# EAGLE design BlinkyTape Controller (EAGLE 7.2.0)
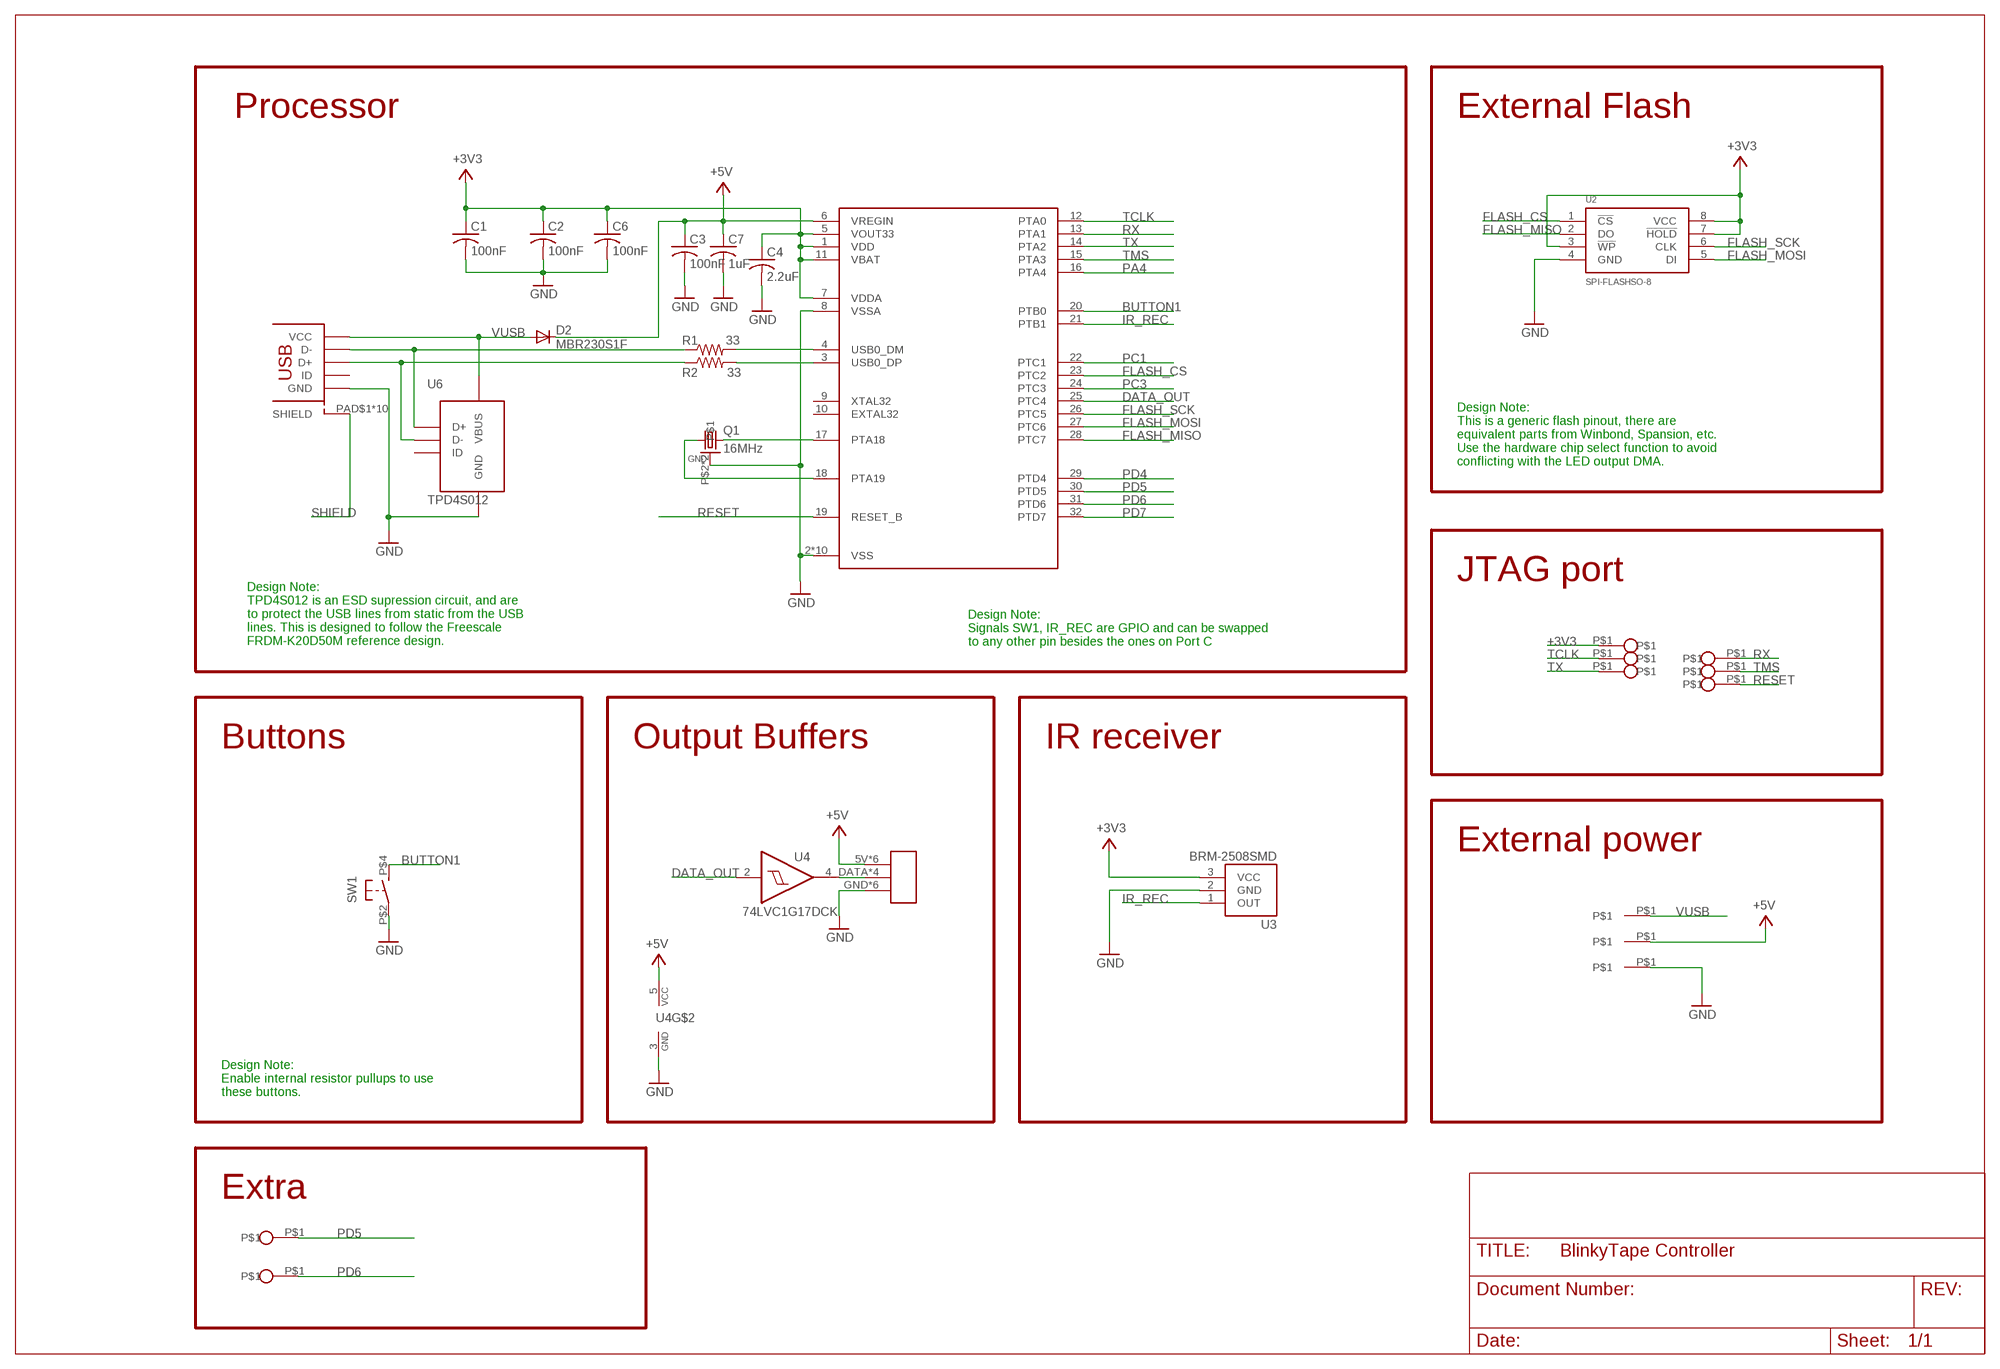
[diagram p0: schematic, sheet 1]

## Parts
C1  100nF  C-USC0402  [C0402]
C2  100nF  C-USC0402  [C0402]
C3  100nF  C-USC0402  [C0402]
C4  2.2uF  C-USC0402  [C0402]
C6  100nF  C-USC0402  [C0402]
C7  1uF  C-USC0603  [C0603]
CON1  USB_MICROSMT+THRUHULE  [USB_MICRO_THRUHOLE]
D2  MBR230S1F  SPARKFUN-DISCRETESEMI_DIODESOD123SOD123  [SOD123]
Q1  16MHz  CRYSTAL_4PAD2520  [CRSYTAL_2520]
R1  33  R-US_R0402  [R0402]
R2  33  R-US_R0402  [R0402]
RECT_PAD1  TEST_PAD_SMTRECT_PAD  [TEST_PAD_SMT]
RECT_PAD2  TEST_PAD_SMTRECT_PAD  [TEST_PAD_SMT]
RECT_PAD3  TEST_PAD_SMTRECT_PAD  [TEST_PAD_SMT]
SW1  BUTTON_MOMENTARY  [BUTTON_MOMENTARY_KMR211G]
U1  MK20D--VFM5  [QFN32_5X5_LONGLEADS]
U2  SPI-FLASHSO-8  [SO08]
U3  BRM-2508SMD  [BRM-2508_SMD]
U4  74LVC1G17DCK  [SC70-5]
U6  TPD4S012  [R-PUSON-N6]
U$1  WS2812B_CONNECTOR  [WS2812B_CONNECTOR_COMBINED]
U$2  POGO_PINSMD  [POGO_PIN_SMD]
U$3  POGO_PINSMD  [POGO_PIN_SMD]
U$4  POGO_PINSMD  [POGO_PIN_SMD]
U$5  POGO_PINSMD  [POGO_PIN_SMD]
U$6  POGO_PINSMD  [POGO_PIN_SMD]
U$7  POGO_PINSMD  [POGO_PIN_SMD]
U$8  POGO_PINSMD  [POGO_PIN_SMD]
U$9  POGO_PINSMD  [POGO_PIN_SMD]

## Nets
+3V3: C1.1 C2.1 C4.1 C6.1 U1.1(VDD) U1.5(VOUT33) U1.7(VDDA) U1.11(VBAT) U2.3(!WP) U2.7(!HOLD) U2.8(VCC) U3.3(VCC) U$2.P$1
+5V: C3.1 C7.1 D2.C RECT_PAD2.P$1 U1.6(VREGIN) U4.5(VCC) U$1.5V U$1.5V1(5V) U$1.5V2(5V) U$1.5V_1(5V) U$1.5V_2(5V) U$1.5V_3(5V)
BUTTON1: SW1.P$4(S) U1.20(PTB0)
DATA_OUT: U1.25(PTC4) U4.2(I)
FLASH_CS: U1.23(PTC2) U2.1(!CS)
FLASH_MISO: U1.28(PTC7) U2.2(DO)
FLASH_MOSI: U1.27(PTC6) U2.5(DI)
FLASH_SCK: U1.26(PTC5) U2.6(CLK)
GND: C1.2 C2.2 C3.2 C4.2 C6.2 C7.2 CON1.PIN$5(GND) Q1.P$2 Q1.P$4 RECT_PAD3.P$1 SW1.P$2(P) U1.2(VSS) U1.8(VSSA) U1.PAD@1(VSS) U1.PAD@2(VSS) U1.PAD@3(VSS) U1.PAD@4(VSS) U1.PAD@5(VSS) U1.PAD@6(VSS) U1.PAD@9(VSS) U1.PAD@10(VSS) U1.PAD@11(VSS) U2.4(GND) U3.2(GND) U4.3(GND) U6.P$4(GND) U$1.GND U$1.GND1(GND) U$1.GND_1(GND) U$1.GND_2(GND) U$1.GND_3(GND) U$1.GND_4(GND)
IR_REC: U1.21(PTB1) U3.1(OUT)
LED_DATA: U4.4(O) U$1.DATA U$1.DATA1(DATA) U$1.DATA_1(DATA) U$1.DATA_2(DATA)
N$1: Q1.P$1 U1.18(PTA19)
N$2: Q1.P$3 U1.17(PTA18)
N$7: CON1.PIN$2(D-) R1.1 U6.P$1(D+)
N$10: CON1.PIN$3(D+) R2.1 U6.P$2(D-)
N$11: R1.2 U1.4(USB0_DM)
N$12: R2.2 U1.3(USB0_DP)
PA4: U1.16(PTA4)
PC1: U1.22(PTC1)
PC3: U1.24(PTC3)
PD4: U1.29(PTD4)
PD5: U1.30(PTD5) U$5.P$1
PD6: U1.31(PTD6) U$9.P$1
PD7: U1.32(PTD7)
RESET: U1.19(RESET_B) U$8.P$1
RX: U1.13(PTA1) U$6.P$1
SHIELD: CON1.PAD$1(SHIELD) CON1.PAD$2(SHIELD) CON1.PAD$3(SHIELD) CON1.PAD$4(SHIELD) CON1.PAD$5(SHIELD) CON1.PAD$6(SHIELD) CON1.PAD$7(SHIELD) CON1.PAD$8(SHIELD) CON1.PAD$9(SHIELD) CON1.PAD$10(SHIELD)
TCLK: U1.12(PTA0) U$3.P$1
TMS: U1.15(PTA3) U$7.P$1
TX: U1.14(PTA2) U$4.P$1
VUSB: CON1.PIN$1(VCC) D2.A RECT_PAD1.P$1 U6.P$6(VBUS)
Unconnected: CON1.PIN$4(ID) U1.9(XTAL32) U1.10(EXTAL32) U6.P$3(ID)

## Notes on the sheet
- Processor | External Flash
- Design Note:
  This is a generic flash pinout, there are
  equivalent parts from Winbond, Spansion, etc.
  Use the hardware chip select function to avoid
  conflicting with the LED output DMA.
- JTAG port
- Design Note:
  Signals SW1, IR_REC are GPIO and can be swapped 
  to any other pin besides the ones on Port C
- Design Note:
  TPD4S012 is an ESD supression circuit, and are
  to protect the USB lines from static from the USB
  lines. This is designed to follow the Freescale
  FRDM-K20D50M reference design.
- Buttons | Output Buffers | IR receiver
- External power
- Design Note:
  Enable internal resistor pullups to use 
  these buttons.
- Extra

## Library data of the parts
C1-C4 C6 C7 = adafruit:C-US: CAPACITOR, American symbol
CON1 = blinkinlabs:USB_MICRO
D2 = PaxInstrument-T400:SPARKFUN-DISCRETESEMI_DIODE: Diode These are standard reverse protection diodes and small signal diodes. SMA package can handle up to about 1A. SOD-323 can handle about 200mA. What the SOD-323 package when ordering, there are some mfgs out there that are 5-pin packages.; MPN: B340A-13-F; OC_DIGIKEY: B340A-FDICT-ND
Q1 = blinkinlabs:CRYSTAL_4PAD
R1 R2 = adafruit:R-US_: RESISTOR, American symbol
RECT_PAD1-RECT_PAD3 = blinkinlabs:TEST_PAD_SMT
SW1 = blinkinlabs:BUTTON_MOMENTARY
U1 = blinkinlabs:MK20D--VFM5
U2 = blinkinlabs:SPI-FLASH
U3 = blinkinlabs:BRM-2508
U4 = 74xx-little-us:74*1G17: Single Schmitt-Trigger Buffer
U6 = blinkinlabs:TPD4S012: TPD4S012 4-Channel ESD Solution for USB-HS/USB OTG/USB Charger Interface
U$1 = blinkinlabs:WS2812B_CONNECTOR
U$2-U$9 = blinkinlabs:POGO_PIN

## Net classes
0 default: width 0.203 mm, drill 0.25 mm
1 power: width 0.305 mm

## Board
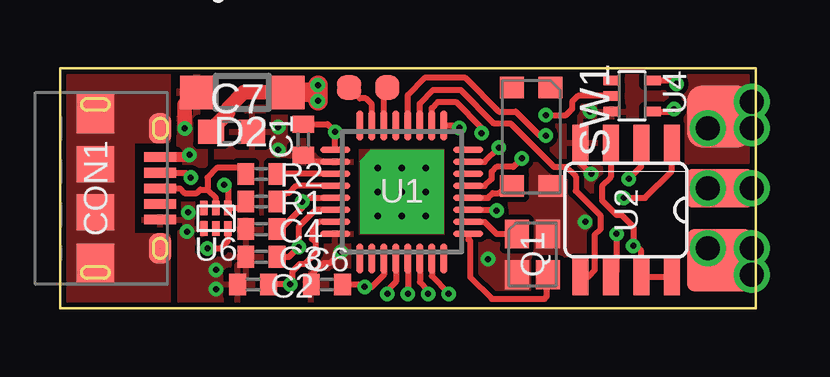
[diagram p1: board, top side]
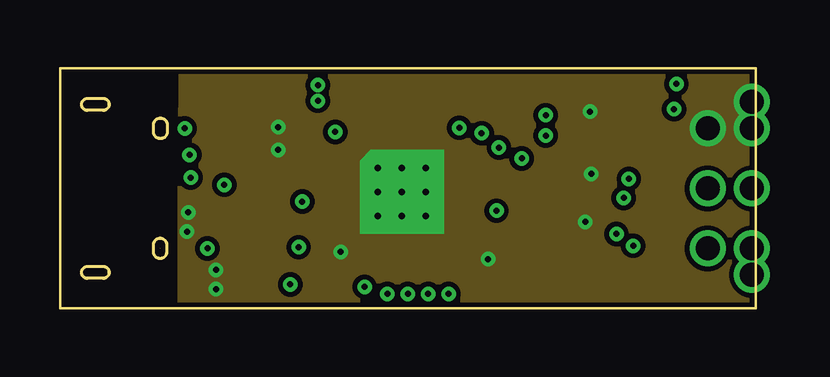
[diagram p2: board, inner layer Route2]
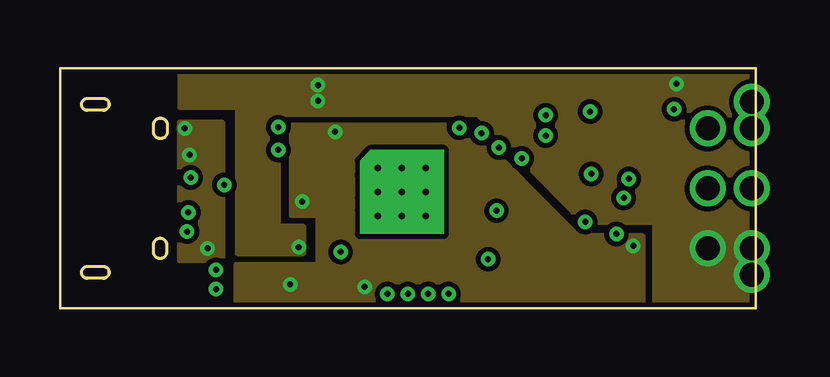
[diagram p3: board, inner layer Route3]
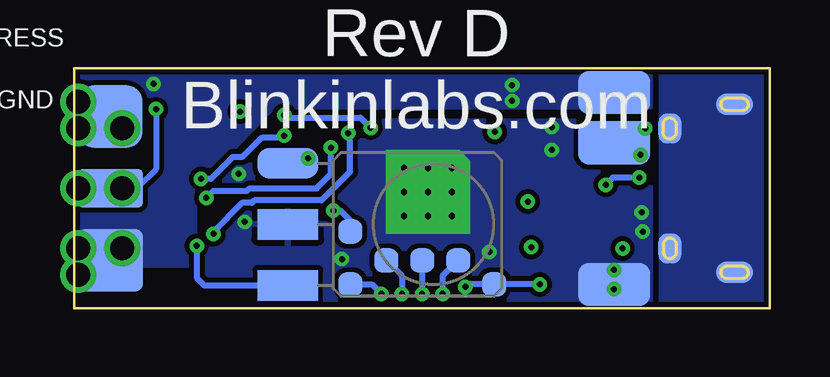
[diagram p4: board, bottom side, seen from below]

Size 29 x 10 mm. Coordinates in mm from the lower left corner, seen from the top.
Outline: 0,10 0,0 29,0 29,10 0,10
Copper layers (1*2*3*16): Top 0.0356mm / dielectric 0.486mm / Route2 0.0356mm / dielectric 0.486mm / Route3 0.0356mm / dielectric 0.486mm / Bottom 0.0356mm
Design rules "BlinkyTape *": minimum track width 6mil, minimum drill 0.25mm, track to track 8mil, track to pad 8mil, pad to pad 8mil, via to via 8mil, smd to smd 8mil, copper to edge 8mil, drill to drill 0.1mm, minimum pad ring 7mil, minimum via ring 7mil, stop-mask expansion 2mil, vias tented up to drill 3mm, thermal gap 10mil
tKeepout: area 23.4,1 to 28.4,7
tRestrict: area 16.2,1.9 to 16.5,2.9; area 16,2.8 to 16.2,6.8; area 12.2,2.9 to 16.2,3; area 12.2,2.8 to 12.4,6.8; area 12.2,6.7 to 16.2,6.8

### Footprints (pad centres in the part's own frame; a part is rotated, then mirrored left to right if it is on the bottom)
C0402 = smd 0.7 x 0.9: 1 -0.65,0; 2 0.65,0
C0603 = smd 1.1 x 1: 1 -0.85,0; 2 0.85,0
USB_MICRO_THRUHOLE = smd 1.645 x 1.55: PAD$1 -3.123,0; PAD$4 3.123,0 | smd 1.5 x 1.55: PAD$2 -1,0; PAD$3 1,0 | smd 1.25 x 0.95: PAD$5 -2.5,2.7; PAD$6 2.5,2.7 | smd 0.9 x 1.55 bottom: PAD$7 -3.5,0; PAD$8 3.5,0 | smd 1.25 x 0.95 bottom: PAD$9 -2.5,2.7; PAD$10 2.5,2.7 | smd 0.4 x 1.35: PIN$1 -1.3,2.7; PIN$2 -0.65,2.7; PIN$3 0,2.7; PIN$4 0.65,2.7; PIN$5 1.3,2.7
SOD123 = smd 1.4 x 1.4: A 1.9,0; C -1.9,0
CRSYTAL_2520 = smd 1.2 x 1: P$1 -0.85,-0.65; P$2 0.85,-0.65; P$3 0.85,0.65; P$4 -0.85,0.65
R0402 = smd 0.7 x 0.9: 1 -0.65,0; 2 0.65,0
TEST_PAD_SMT = smd 1.8 x 3: P$1 0,0
BUTTON_MOMENTARY_KMR211G = smd 0.9 x 1: P$1 -2,0.8; P$2 2.1,0.8; P$3 -2,-0.8; P$4 2.1,-0.8
QFN32_5X5_LONGLEADS = smd 1.25 x 0.275: 1 -2.775,1.75; 2 -2.775,1.25; 3 -2.775,0.75; 4 -2.775,0.25; 5 -2.775,-0.25; 6 -2.775,-0.75; 7 -2.775,-1.25; 8 -2.775,-1.75; 17 2.775,-1.75; 18 2.775,-1.25; 19 2.775,-0.75; 20 2.775,-0.25; 21 2.775,0.25; 22 2.775,0.75; 23 2.775,1.25; 24 2.775,1.75 | smd 0.275 x 1.25: 9 -1.75,-2.775; 10 -1.25,-2.775; 11 -0.75,-2.775; 12 -0.25,-2.775; 13 0.25,-2.775; 14 0.75,-2.775; 15 1.25,-2.775; 16 1.75,-2.775; 25 1.75,2.775; 26 1.25,2.775; 27 0.75,2.775; 28 0.25,2.775; 29 -0.25,2.775; 30 -0.75,2.775; 31 -1.25,2.775; 32 -1.75,2.775 | drill 0.254 pad 1.5 octagon: PAD@1 -1,1 | drill 0.254 pad 1.5 square: PAD@2 0,1; PAD@3 1,0; PAD@4 1,1; PAD@5 -1,0; PAD@6 0,0; PAD@9 -1,-1; PAD@10 0,-1; PAD@11 1,-1
SO08 = smd 0.66 x 1.524: 1 -1.905,-2.794; 2 -0.635,-2.794; 3 0.635,-2.794; 4 1.905,-2.794; 5 1.905,2.794; 6 0.635,2.794; 7 -0.635,2.794; 8 -1.905,2.794
BRM-2508_SMD = smd 1.27 x 2.54: 1 -2.54,0; 2 0,0; 3 2.54,0
SC70-5 = smd 0.4 x 0.7: 1 -0.65,-0.85; 2 0,-0.85; 3 0.65,-0.85; 4 0.65,0.85; 5 -0.65,0.85
R-PUSON-N6 = smd 0.3 x 0.6: P$1 -0.5,-0.425; P$2 0,-0.425; P$3 0.5,-0.425; P$4 0.5,0.425; P$5 0,0.425; P$6 -0.5,0.425
WS2812B_CONNECTOR_COMBINED = smd 2.7 x 1.6 bottom: 5V 0,3; DATA1 0,0 | smd 2.7 x 2.6: 5V1 0,3; GND 0,-3 | smd 2.7 x 2.6 bottom: 5V2 0,3; GND1 0,-3 | drill 1: 5V_1 1.35,2.5; 5V_2 -0.5,2.5; 5V_3 1.35,3.6 | smd 2.7 x 1.6: DATA 0,0 | drill 1 pad 1.5: DATA_1 1.35,0; DATA_2 -0.5,0; GND_1 1.35,-2.5; GND_2 -0.5,-2.5; GND_3 1.35,-2.5; GND_4 1.35,-3.6
POGO_PIN_SMD = smd 1 x 1: P$1 0,0

### Placement (x,y rotation side)
C1  10.15,7.03 270 top
C2  8.05,1 180 top
C3  8.4,2.15 180 top
C4  8.4,3.3 180 top
C6  11.12,1 180 top
C7  7.15,7.35 0 top
CON1  1.48,5 270 top
D2  7.6,9 180 top
Q1  19.7,2.25 270 top
R1  8.4,4.45 0 top
R2  8.4,5.6 0 top
RECT_PAD1  6.5,6.9 270 bottom
RECT_PAD2  6.5,9 90 bottom
RECT_PAD3  6.5,1 90 bottom
SW1  19.65,7.2 270 top
U1  14.25,4.85 0 top
U2  23.6,4.1 180 top
U3  20.1,3.5 270 bottom
U4  23.85,8.85 270 top
U6  6.5,3.75 180 top
U$1  27.5,5 180 bottom
U$2  11.5,1 90 bottom
U$3  13,2 90 bottom
U$4  16,2 90 bottom
U$5  13.65,9.2 0 top
U$6  14.5,2 90 bottom
U$7  17.5,1 90 bottom
U$8  17.5,3.2 90 bottom
U$9  12.05,9.2 0 top

### Tracks (layer width: path | path; a pad name or v marks a point on that pad's centre or on a via)
+3V3  (via drill 0.25)
  Top 0.254: U1.5 10.25,4.6 v10.1,4.45 10.1,4.2 9.2,3.3 C4.1 | U1.7 10.8,3.6 10.5,3.3 10.5,2.9 10.65,2.75 10.65,2.3 10.2,1.85 10,1.85 9.7,1.55 9.7,1.1 v9.6,1 C2.1 | U1.1 v11.47,7.35 11.15,7.67 C1.1 | U2.8 U2.7 24.23,2.4 24.03,2.61 v23.9,2.61 23.9,3.4 23.4,3.9 23.2,3.9 22.6,4.5 22.6,5.1 22.96,5.46 U2.3 | U1.11 13.5,1.4 13,0.9 v12.7,0.9 12.6,1 C6.1
  Bottom 0.254: v9.6,1 U$2.P$1 12.8,1 | v23.9,2.61 23.9,1.28 23.58,0.96 U3.3
  pour Route3: 9.65,7.6 9.65,3.9 10.75,3.9 10.75,1.8 7.35,1.8 7.35,0 24.3,0 24.3,3 21.6,3 17,7.6
+5V  (via drill 0.25)  (1 unrouted)
  Top 0.254: U1.6 10.65,4.1 9.95,3.4 v9.95,2.55 9.55,2.15 C3.1 | U4.5 25.55,9.5 v25.7,9.35
  Top 0.61: D2.C 7.65,9 7,8.35 7,8.15 6.3,7.45 C7.1
  Top 0.813: v10.75,9.3 v10.75,8.65 10.75,9 D2.C
  pour Bottom: 5,10 5,8.4 20.7,8.4 24,5 24,1.8 29,1.8 29,10
  pour Route3: 5,10 5,8.4 7.4,8.4 7.4,2.3 10.15,2.3 10.15,3.4 9.1,3.4 9.1,8.1 17.4,8.1 21.8,3.6 24.8,3.6 24.8,0 29,0 29,10
BUTTON1
  Top 0.254: U1.20 17.85,4.6 18.05,4.8 18.3,4.8 18.6,5.1 SW1.P$4
DATA_OUT  (via drill 0.25)
  Top 0.254: U1.25 16.55,7.62 v16.65,7.53 | U4.2 21.6,8.85 21.35,8.6 21.35,8.3 21.1,8.05 v20.25,8.05
  Bottom 0.254: v20.25,8.05 20.15,7.95 17.07,7.95 v16.65,7.53
FLASH_CS  (via drill 0.25)
  Top 0.254: U1.23 17.7,6.1 v18.3,6.7 | v23.5,4.6 24.39,4.6 25.5,5.72 U2.1
  Bottom 0.254: v23.5,4.6 23.2,4.9 21.8,4.9 21.7,5 18.9,5 18.3,5.6 v18.3,6.7
FLASH_MISO  (via drill 0.25)
  Top 0.254: v23.72,5.4 24.23,5.92 U2.2 | U1.28 14.5,8.9 15.2,9.6 16.9,9.6 18.3,8.2 19,8.2 20,7.2 v20.25,7.2
  Bottom 0.254: 23.72,5.48 v23.72,5.4 23.3,5.4 22.4,6.3 22,6.3 21.2,7.1 20.35,7.1 v20.25,7.2
FLASH_MOSI
  Top 0.254: U1.27 15,8.55 15.55,9.1 16.7,9.1 18.1,7.7 18.8,7.7 20.6,5.9 21.1,5.9 21.5,5.5 21.5,4.9 22.55,3.85 22.55,3.31 22.3,3.06 22.3,1.6 22.01,1.31 U2.5
FLASH_SCK  (via drill 0.25)
  Top 0.254: U1.26 15.5,8.35 15.75,8.6 16.5,8.6 17.58,7.52 v17.58,7.3 | v23.2,3.1 23.2,1.54 U2.6
  Bottom 0.254: v23.2,3.1 23.2,3.2 22,4.4 21.6,4.4 21.5,4.5 18.7,4.5 17.5,5.7 17.5,7.22 v17.58,7.3
GND  (via drill 0.25, 0.25 pad 0.2)  (1 unrouted)
  Top 0.254: U2.4 21.7,6.05 v22.15,5.6 | C6.2 10.47,1.38 11,1.9 11.25,1.9 v11.7,2.35 | U1.2 10.43,6.1 C1.2
  other vias: 17.85,2.05 6.5,1.6 9.1,7.55 9.1,6.6 6.5,0.8 21.9,3.6 5.35,4 5.3,3.2 22.1,8.2
  pour Top: 6.6,10 6.5,5.5 3.5,5.5 3.5,3.5 5,3.5 5,0 29,0 29,10
  pour Bottom: 5,7.8 5,0 29,0 29,1.3 23.5,1.3 23.5,4.8 20.6,7.8
  pour Route2: 5.05,10 5,3.5 5,0 29.3,0 29.3,10
IR_REC  (via drill 0.25)
  Top 0.254: U1.21 17.7,5.1 18,5.4 18,5.7 18.2,5.9 18.9,5.9 v19.25,6.25
  Bottom 0.254: U3.1 19.46,6.04 v19.25,6.25
LED_DATA  (via drill 0.25)  (1 unrouted)
  Top 0.254: U$1.DATA_2 U$1.DATA1 U$1.DATA_1 | U4.4 25.5,8.2 v25.6,8.3
  Bottom 0.254: v25.6,8.3 25.6,5.8 26.4,5 U$1.DATA_2
N$1
  Top 0.254: U1.18 17.7,3.6 18.2,3.1 Q1.P$1
N$2
  Top 0.254: Q1.P$3 20.3,1.35 20.3,0.5 20.2,0.4 18,0.4 17.1,1.3 17.1,2.8 17.02,2.88 U1.17
N$7  (via drill 0.25)
  Top 0.254: 7.78,4.38 arc-45 7.96,4.45 R1.1 7.5,4.2 7,4.2 | 7,4.5 7,4.2 | 7,4.2 U6.P$1 7,5 v6.85,5.15 | CON1.PIN$2 5.25,5.65 v5.45,5.45
  Bottom 0.254: v5.45,5.45 6.55,5.45 v6.85,5.15
N$10
  Top 0.254: U6.P$2 6.5,4.6 6.15,4.95 | R2.1 7.75,5.7 7.6,5.85 6.55,5.85 6.15,5.45 6.15,4.95 | CON1.PIN$3 5,5 5.2,4.8 5.7,4.8 5.85,4.95 6.15,4.95
N$11
  Top 0.254: U1.4 9.85,5.1 9.55,4.8 9.4,4.8 R1.2
N$12
  Top 0.254: U1.3 R2.2
PD5
  Top 0.254: U1.30 13.5,9.05 U$5.P$1
PD6
  Top 0.254: U1.31 13,8.5 12.75,8.75 12.5,8.75 U$9.P$1
RESET  (via drill 0.25)
  Top 0.254: U1.19 18.2,4.1 v18.2,4.07
  Bottom 0.254: v18.2,4.07 17.9,4.07 17.5,3.67 U$8.P$1
RX  (via drill 0.25)
  Top 0.254: U1.13 v14.5,0.6
  Bottom 0.254: U$6.P$1 v14.5,0.6
SHIELD  (1 unrouted)
  pour Top: 4.5,10 0,10 0,0 4.5,0 4.5,3 3,3 3,7 4.5,7
  pour Bottom: 4.5,10 0,10 0,0 4.5,0
TCLK  (via drill 0.25)
  Top 0.254: U1.12 14,1.1 13.65,0.75 v13.65,0.6
  Bottom 0.254: U$3.P$1 13.65,1.35 v13.65,0.6
TMS  (via drill 0.25)
  Top 0.254: v16.2,0.6 16.2,0.65 15.5,1.35 U1.15
  Bottom 0.254: U$7.P$1 16.6,1 v16.2,0.6
TX  (via drill 0.25)
  Top 0.254: U1.14 15,1.1 15.35,0.75 v15.35,0.6
  Bottom 0.254: U$4.P$1 15.35,1.35 v15.35,0.6
VUSB  (via drill 0.25)
  Top 0.254: v6.15,2.5 6.7,2.5 7,2.8 U6.P$6
  Top 0.406: v5.4,6.4 5.3,6.3 CON1.PIN$1
  Top 0.61: v5.2,7.5 5.2,8.5 D2.A
  Bottom 0.61: RECT_PAD1.P$1 5.8,6.9 v5.2,7.5
  pour Top: 6,10 6,6 5,6 5,10
  pour Route3: 5,7.75 6.75,7.75 6.75,2 5,2

### Text on the board
bNames: +5V | DATA | Blinkinlabs / LED Buddy / Rev D / Blinkinlabs.com | ADDRESS | GND